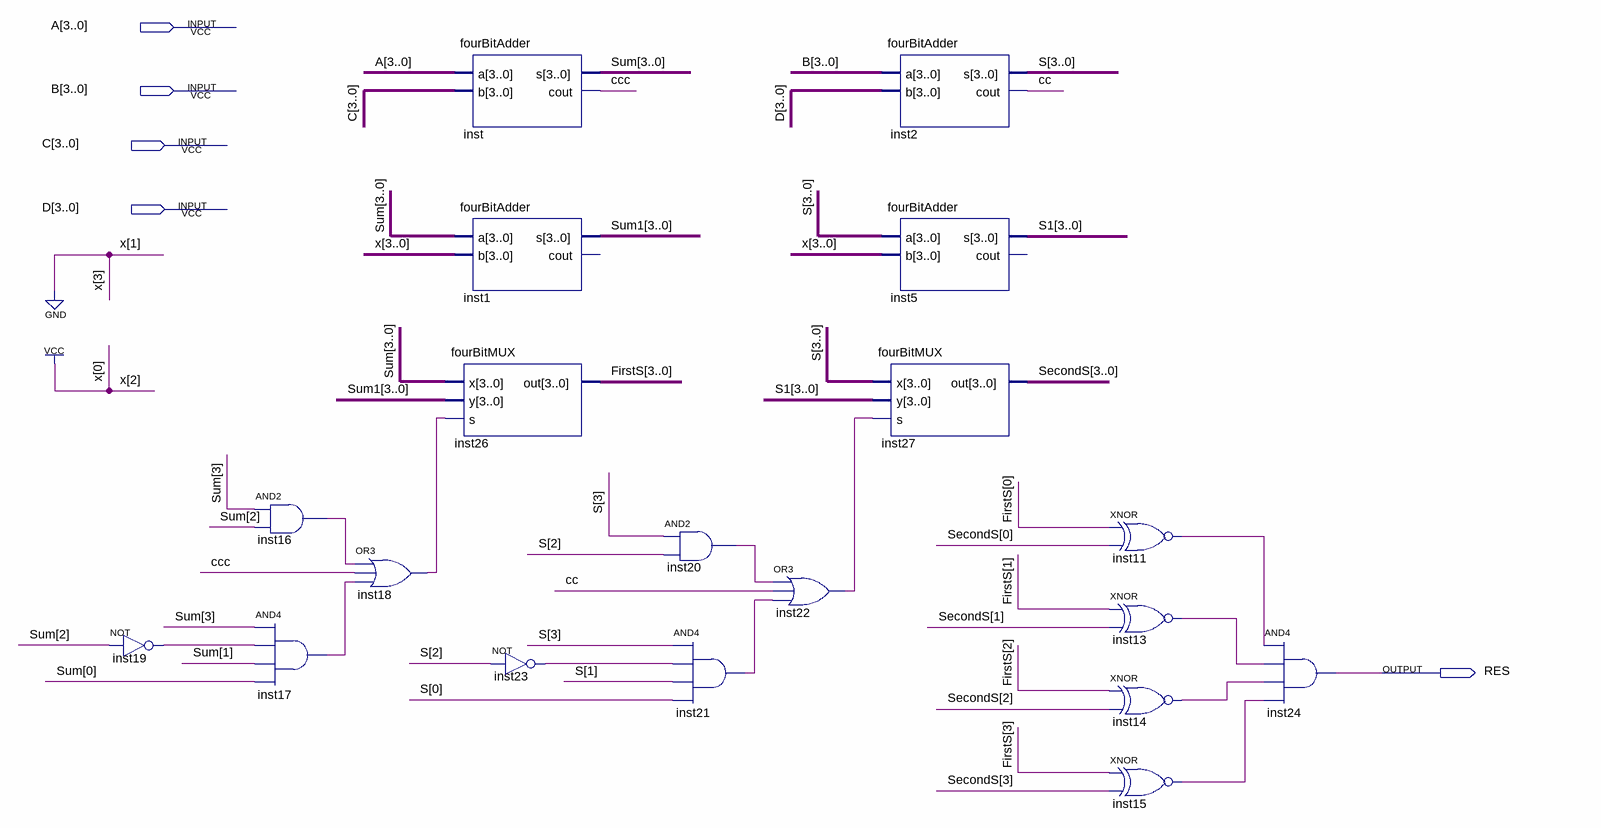
[diagram p0: schematic sheet]
// Quartus schematic RemainderOf11.bdf as structural Verilog: 19 symbols, 5 pins
module RemainderOf11 (
  input  [3:0] A,
  input  [3:0] B,
  input  [3:0] C,
  input  [3:0] D,
  output RES
);

  wire cc, ccc, inst11_out, inst13_out, inst14_out, inst15_out, inst16_out, inst17_out, inst18_out,
       inst19_out, inst20_out, inst21_out, inst22_out, inst23_out;
  wire [3:0] FirstS, S, S1, SecondS, Sum, Sum1;

  not inst19 (inst19_out, Sum[2]);
  and inst16 (inst16_out, Sum[3], Sum[2]);
  and inst17 (inst17_out, Sum[3], inst19_out, Sum[1], Sum[0]);
  or inst18 (inst18_out, inst16_out, ccc, inst17_out);
  fourBitAdder inst (.a(A), .b(C), .s(Sum), .cout(ccc));
  fourBitAdder inst1 (.a(Sum), .b(4'b0101), .s(Sum1));  // open: cout
  fourBitMUX inst26 (.x(Sum), .y(Sum1), .s(inst18_out), .out(FirstS));
  not inst23 (inst23_out, S[2]);
  and inst20 (inst20_out, S[3], S[2]);
  and inst21 (inst21_out, S[3], inst23_out, S[1], S[0]);
  or inst22 (inst22_out, inst20_out, cc, inst21_out);
  fourBitAdder inst2 (.a(B), .b(D), .s(S), .cout(cc));
  fourBitAdder inst5 (.a(S), .b(4'b0101), .s(S1));  // open: cout
  fourBitMUX inst27 (.x(S), .y(S1), .s(inst22_out), .out(SecondS));
  xnor inst11 (inst11_out, FirstS[0], SecondS[0]);
  xnor inst13 (inst13_out, FirstS[1], SecondS[1]);
  xnor inst14 (inst14_out, FirstS[2], SecondS[2]);
  xnor inst15 (inst15_out, FirstS[3], SecondS[3]);
  and inst24 (RES, inst11_out, inst13_out, inst14_out, inst15_out);
endmodule
